# EAGLE design mainboard (EAGLE 9.5.2)
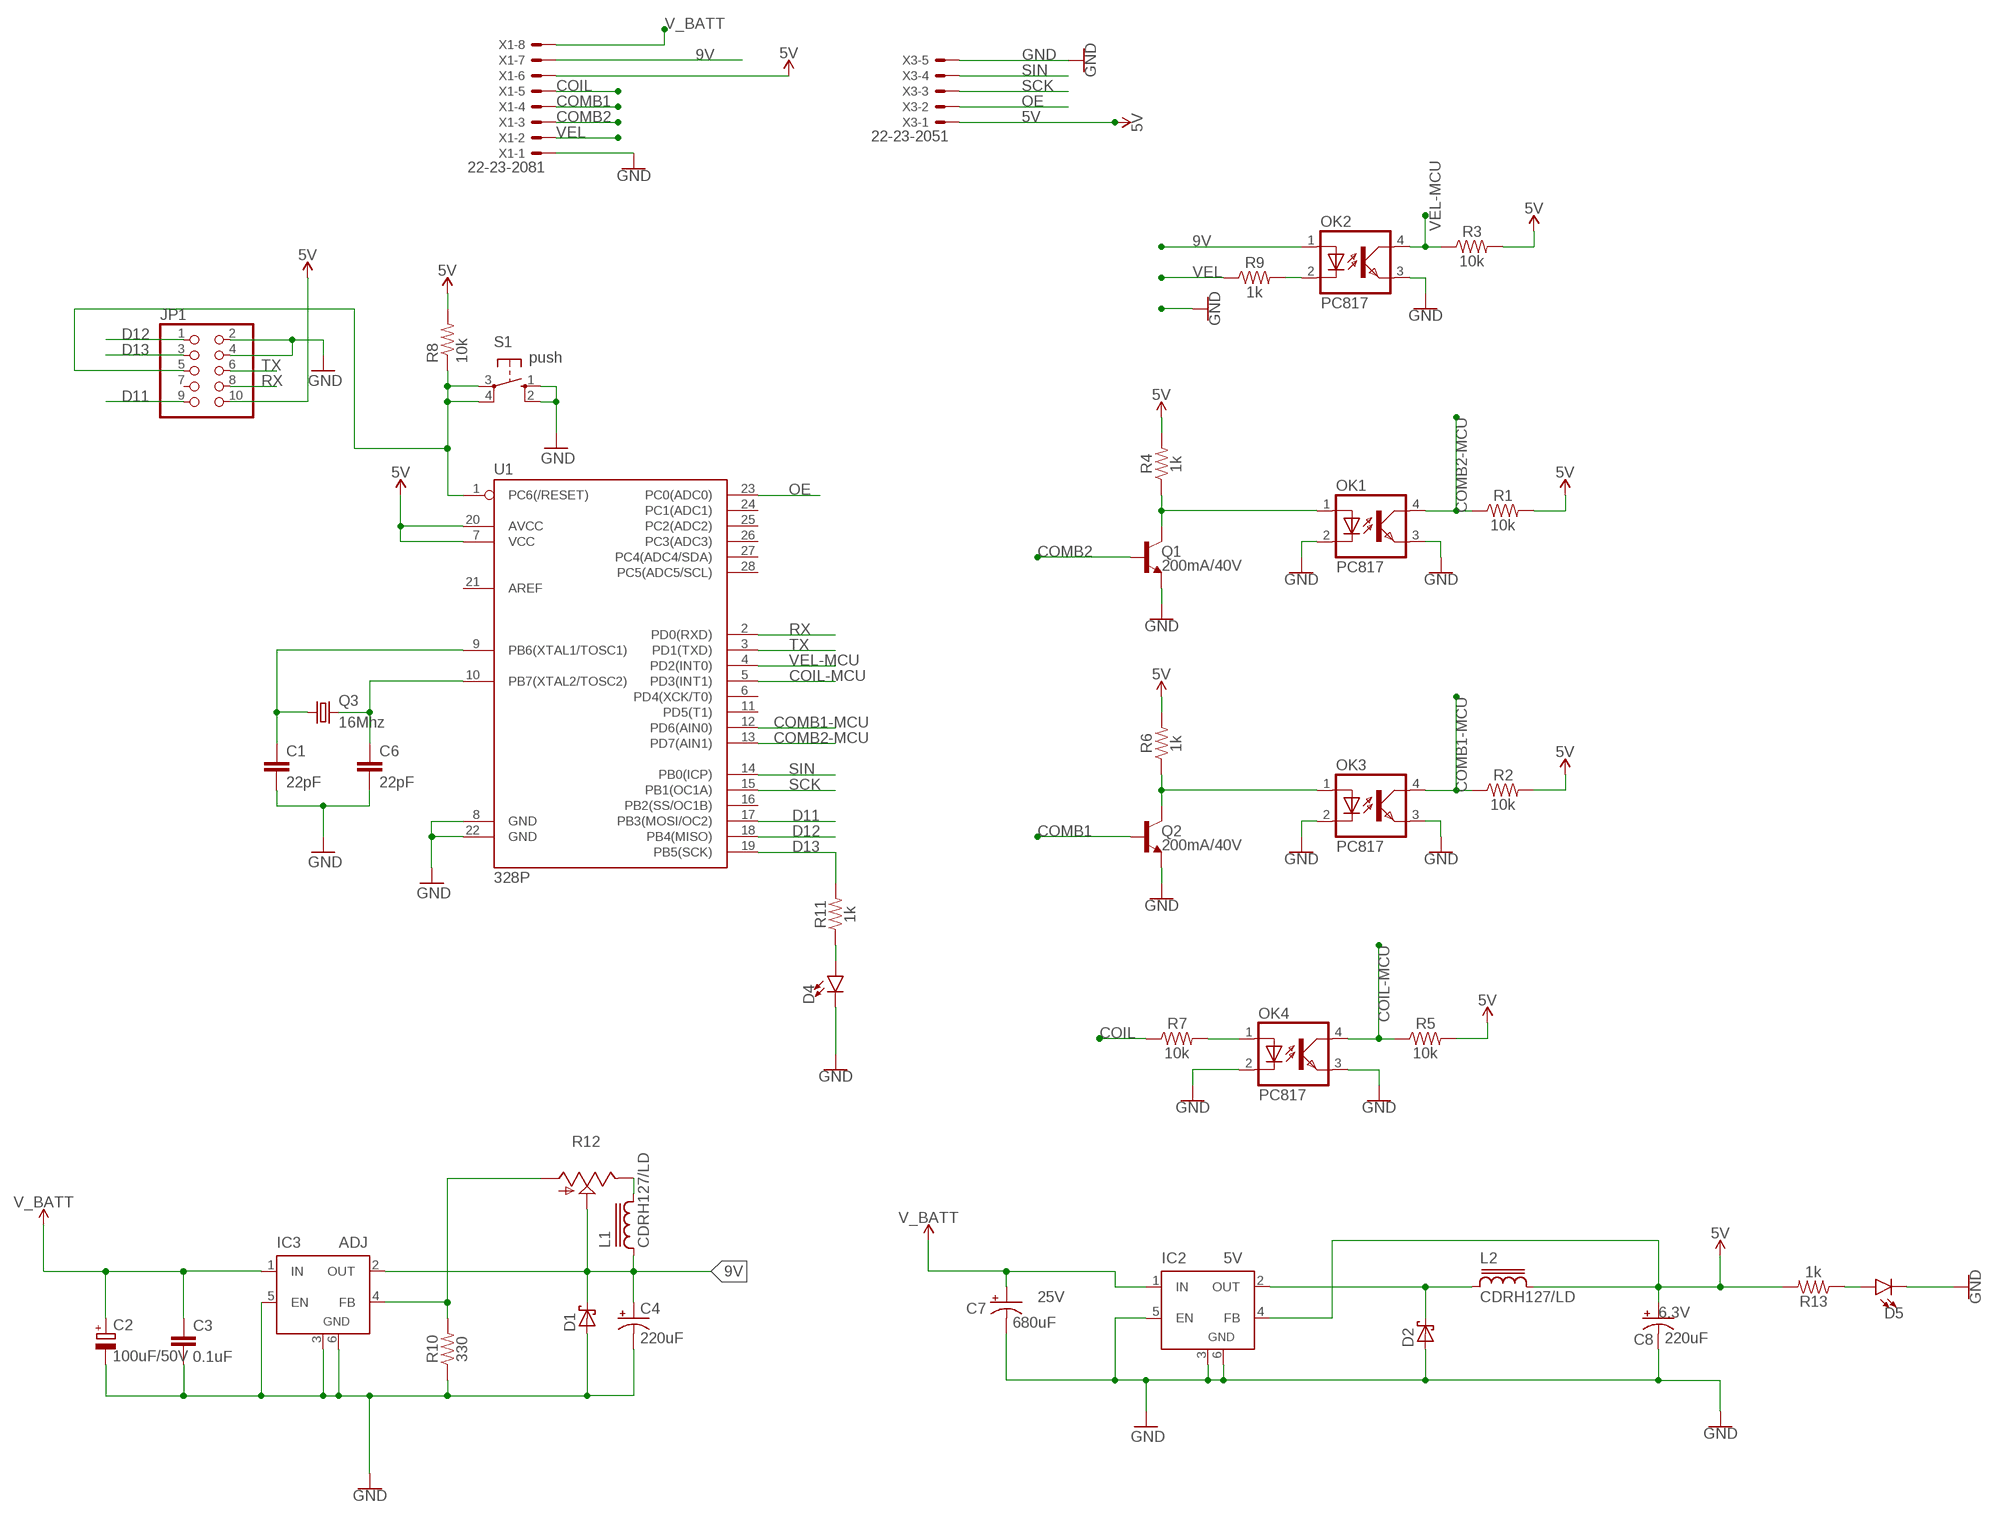
[diagram p0: schematic, sheet 1]

## Parts
C1  22pF  22PF-PTH-2.54MM-200V-5%  [CAP-PTH-2.54]
C2  100uF/50V  CPOL-EUE3.5-8  [E3,5-8]
C3  0.1uF  0.1UF-0603-25V-5%  [0603]
C4  220uF  CPOL-USUD-6,3X5,8  [UD-6,3X5,8_NICHICON]
C6  22pF  22PF-PTH-2.54MM-200V-5%  [CAP-PTH-2.54]
C7  680uF  CPOL-USE5-10.5  [E5-10,5]
C8  220uF  CPOL-USUD-6,3X5,8  [UD-6,3X5,8_NICHICON]
D1  SCHOTTKY-DIODESMD  [SMB]
D2  SCHOTTKY-DIODESMD  [SMB]
D4  LED3MM  [LED_3MM]
D5  LED3MM  [LED_3MM]
IC2  5V  LM2596S  [TO263-5]
IC3  ADJ  LM2596S  [TO263-5]
JP1  PINHD-2X5  [2X05]
L1  CDRH127/LD  [CDRH127/LD]
L2  CDRH127/LD  [CDRH127/LD]
OK1  PC817  [DIL04]
OK2  PC817  [DIL04]
OK3  PC817  [DIL04]
OK4  PC817  [DIL04]
Q1  200mA/40V  TRANS_NPN-2N3904  [TO-92]
Q2  200mA/40V  TRANS_NPN-2N3904  [TO-92]
Q3  16Mhz  CRYSTALHC49U-V  [HC49U-V]
R1  10k  10KOHM-HORIZ-1/4W-5%  [AXIAL-0.3]
R2  10k  10KOHM-HORIZ-1/4W-5%  [AXIAL-0.3]
R3  10k  10KOHM-HORIZ-1/4W-5%  [AXIAL-0.3]
R4  1k  1KOHM-HORIZ-1/4W-5%  [AXIAL-0.3]
R5  10k  10KOHM-HORIZ-1/4W-5%  [AXIAL-0.3]
R6  1k  1KOHM-HORIZ-1/4W-5%  [AXIAL-0.3]
R7  10k  10KOHM-HORIZ-1/4W-5%  [AXIAL-0.3]
R8  10k  10KOHM-HORIZ-1/4W-5%  [AXIAL-0.3]
R9  1k  1KOHM-HORIZ-1/4W-5%  [AXIAL-0.3]
R10  330  1KOHM-HORIZ-1/4W-5%  [AXIAL-0.3]
R11  1k  1KOHM-HORIZ-1/4W-5%  [AXIAL-0.3]
R12  TRIM_US-S64W  [S64W]
R13  1k  1KOHM-HORIZ-1/4W-5%  [AXIAL-0.3]
S1  push  10-XX  [B3F-10XX]
U1  328P  ATMEGA328P_PDIP  [DIP28]
X1  22-23-2081  [22-23-2081]
X3  22-23-2051  [22-23-2051]

## Nets
5V: C8.+ IC2.4(FB) JP1.10 L2.2 R1.P$2 R2.P$2 R3.P$2 R4.P$2 R5.P$2 R6.P$2 R8.P$2 R13.P$2 U1.7(VCC) U1.20(AVCC) X1.6 X3.1
9V: C4.+ D1.C IC3.2(OUT) L1.1 OK2.1(A) R12.S X1.7
COIL: R7.P$1 X1.5
COIL-MCU: OK4.4(COL) R5.P$1 U1.5(PD3(INT1))
COMB1: Q2.2(B) X1.4
COMB1-MCU: OK3.4(COL) R2.P$1 U1.12(PD6(AIN0))
COMB2: Q1.2(B) X1.3
COMB2-MCU: OK1.4(COL) R1.P$1 U1.13(PD7(AIN1))
D11: JP1.9 U1.17(PB3(MOSI/OC2))
D12: JP1.1 U1.18(PB4(MISO))
D13: JP1.3 R11.P$2 U1.19(PB5(SCK))
GND: C1.2 C2.- C3.2 C4.- C6.2 C7.- C8.- D1.A D2.A D4.K(C) D5.K(C) IC2.3(GND) IC2.5(EN) IC2.6(GND) IC3.3(GND) IC3.5(EN) IC3.6(GND) JP1.2 JP1.4 OK1.2(C) OK1.3(EMIT) OK2.3(EMIT) OK3.2(C) OK3.3(EMIT) OK4.2(C) OK4.3(EMIT) Q1.1(E) Q2.1(E) R10.P$1 S1.1(S) S1.2(S1) U1.8(GND) U1.22(GND) X1.1 X3.5
N$1: OK4.1(A) R7.P$2
N$2: OK2.2(C) R9.P$2
N$3: OK1.1(A) Q1.3(C) R4.P$1
N$4: OK3.1(A) Q2.3(C) R6.P$1
N$5: C1.1 Q3.1 U1.9(PB6(XTAL1/TOSC1))
N$6: C6.1 Q3.2 U1.10(PB7(XTAL2/TOSC2))
N$7: JP1.5 R8.P$1 S1.3(P) S1.4(P1) U1.1(PC6(/RESET))
N$8: D5.A R13.P$1
N$9: L1.2 R12.E
N$10: IC3.4(FB) R10.P$2 R12.A
N$11: D4.A R11.P$1
OE: U1.23(PC0(ADC0)) X3.2
OUT: D2.C IC2.2(OUT) L2.1
RX: JP1.8 U1.2(PD0(RXD))
SCK: U1.15(PB1(OC1A)) X3.3
SIN: U1.14(PB0(ICP)) X3.4
TX: JP1.6 U1.3(PD1(TXD))
V_BATT: C2.+ C3.1 C7.+ IC2.1(IN) IC3.1(IN) X1.8
VEL: R9.P$1 X1.2
VEL-MCU: OK2.4(COL) R3.P$1 U1.4(PD2(INT0))
Unconnected: JP1.7 U1.6(PD4(XCK/T0)) U1.11(PD5(T1)) U1.16(PB2(SS/OC1B)) U1.21(AREF) U1.24(PC1(ADC1)) U1.25(PC2(ADC2)) U1.26(PC3(ADC3)) U1.27(PC4(ADC4/SDA)) U1.28(PC5(ADC5/SCL))

## Library data of the parts
C1 C6 = SparkFun-Capacitors:22PF: 22pF ceramic capacitors A capacitor is a passive two-terminal electrical component used to store electrical energy temporarily in an electric field.; PROD_ID: CAP-09128
C2 = rcl:CPOL-EU: POLARIZED CAPACITOR, European symbol; SPICEPREFIX: C
C3 = SparkFun-Capacitors:0.1UF: 0.1µF ceramic capacitors A capacitor is a passive two-terminal electrical component used to store electrical energy temporarily in an electric field.; PROD_ID: CAP-08604
C4 = rcl:CPOL-US: POLARIZED CAPACITOR, American symbol; SPICEPREFIX: C
C7 = rcl:CPOL-US: POLARIZED CAPACITOR, American symbol; VOLTAGE: 25V
C8 = rcl:CPOL-US: POLARIZED CAPACITOR, American symbol; VOLTAGE: 6.3V
D1 D2 = diode:SCHOTTKY-DIODE: Schottky Diode
D4 D5 = SparkFun-LED:LED: LED (Generic) Standard schematic elements and footprints for 5mm, 3mm, 1206, and 0603 sized LEDs. Generic LEDs with no color specified.; PROD_ID: DIO-08794
IC2 IC3 = linear:LM2596S: STEP-DOWN VOLTAGE REGULATOR
JP1 = pinhead:PINHD-2X5: PIN HEADER
L1 L2 = inductor-sumida:CDRH127/LD: Power Inductor
OK1-OK4 = optocoupler:PC817: SHARP OPTO COUPLER; MPN: PC817X4J000F; OC_FARNELL: 9707727; OC_NEWARK: 97K7059
Q1 Q2 = SparkFun-DiscreteSemi:TRANS_NPN: NPN transistor Current controlled devices typically used to amplify current or used as a switch. BC547 - COM-08928 <http://www.sparkfun.com/products/8928> (TO-92 45V 100mA) (1.Collector 2.Base 3.Emitter) 2N3904 - COM-00521 <http://www.sparkfun.com/products/521> (TO-92 40V 200mA) (1.Emitter 2.Base 3.Collector) P2N2222A - COM-12852 <http://www.sparkfun.com/products/12852> (TO-92 40V 600mA) (1.Collector 2.Base 3.Emitter); PROD_ID: TRANS-08447
Q3 = adafruit:CRYSTAL: CRYSTAL; OC_FARNELL: 1666969; OC_NEWARK: unknown
R1-R3 R5 R7 R8 = SparkFun-Resistors:10KOHM: 10kΩ resistor A resistor is a passive two-terminal electrical component that implements electrical resistance as a circuit element. Resistors act to reduce current flow, and, at the same time, act to lower voltage levels within circuits. - Wikipedia; PROD_ID: RES-09435
R4 R6 R9 R11 R13 = SparkFun-Resistors:1KOHM: 1kΩ resistor A resistor is a passive two-terminal electrical component that implements electrical resistance as a circuit element. Resistors act to reduce current flow, and, at the same time, act to lower voltage levels within circuits. - Wikipedia; PROD_ID: RES-08380
R10 = SparkFun-Resistors:1KOHM: 1kΩ resistor A resistor is a passive two-terminal electrical component that implements electrical resistance as a circuit element. Resistors act to reduce current flow, and, at the same time, act to lower voltage levels within circuits. - Wikipedia; PROD_ID: RES-08380; VALUE: 1k
R12 = pot:TRIM_US-: POTENTIOMETER
S1 = switch-omron:10-XX: OMRON SWITCH; MPN: B3F-1000; OC_FARNELL: 176432; OC_NEWARK: 36M3542
U1 = SparkFun-IC-Microcontroller:ATMEGA328P_PDIP: Atmel 328P Through hole ATMEGA328P uC used in the Arduino 32kb flash, 1k EEPROM, 2k SRAM Datasheet <http://www.sparkfun.com/datasheets/Components/SMD/ATMega328.pdf> SparkFun Products Storefront component: AVR 28 Pin 20MHz 32K 6A/D - ATMega328P <https://www.sparkfun.com/products/9061> (COM-09061) SparkFun Simon Says - Through-Hole Soldering Kit <https://www.sparkfun.com/products/10547> (KIT-10547) SparkFun Learn to Solder - Simon Says <https://www.sparkfun.com/products/13708> (KIT-13708) SparkFun BigTime Watch Kit <https://www.sparkfun.com/products/11734> (KIT-11734) SparkFun ClockIt <https://www.sparkfun.com/products/10930> (KIT-10930) SparkFun Serial Enabled LCD Kit <https://www.sparkfun.com/products/10097> (LCD-10097) SparkFun Simon Tilts - Through Hole Soldering Kit <https://www.sparkfun.com/products/12634> (KIT-12634) SparkFun Frequency Counter Kit <https://www.sparkfun.com/products/10140> (KIT-10140) FabFM Radio Kit <https://www.sparkfun.com/products/11043> (KIT-11043) SparkFun Binary Blaster Kit <https://www.sparkfun.com/products/12037> (KIT-12037) SparkFun Metro-Gnome <https://www.sparkfun.com/products/9236> (KIT-09236) ATmega328 with Arduino Optiboot (Uno) <https://www.sparkfun.com/products/10524> (DEV-10524); PROD_ID: IC-09136
X1 = con-molex:22-23-2081: .100" (2.54mm) Center Header - 8 Pin; MF: MOLEX; MPN: 22-23-2081; OC_FARNELL: 1756826; OC_NEWARK: 01C7592
X3 = con-molex:22-23-2051: .100" (2.54mm) Center Header - 5 Pin; MF: MOLEX; MPN: 22-23-2051; OC_FARNELL: 1462952; OC_NEWARK: 38C9178

## Net classes
0 default: width 1.27 mm
1 supply1: width 1.5 mm

## Board
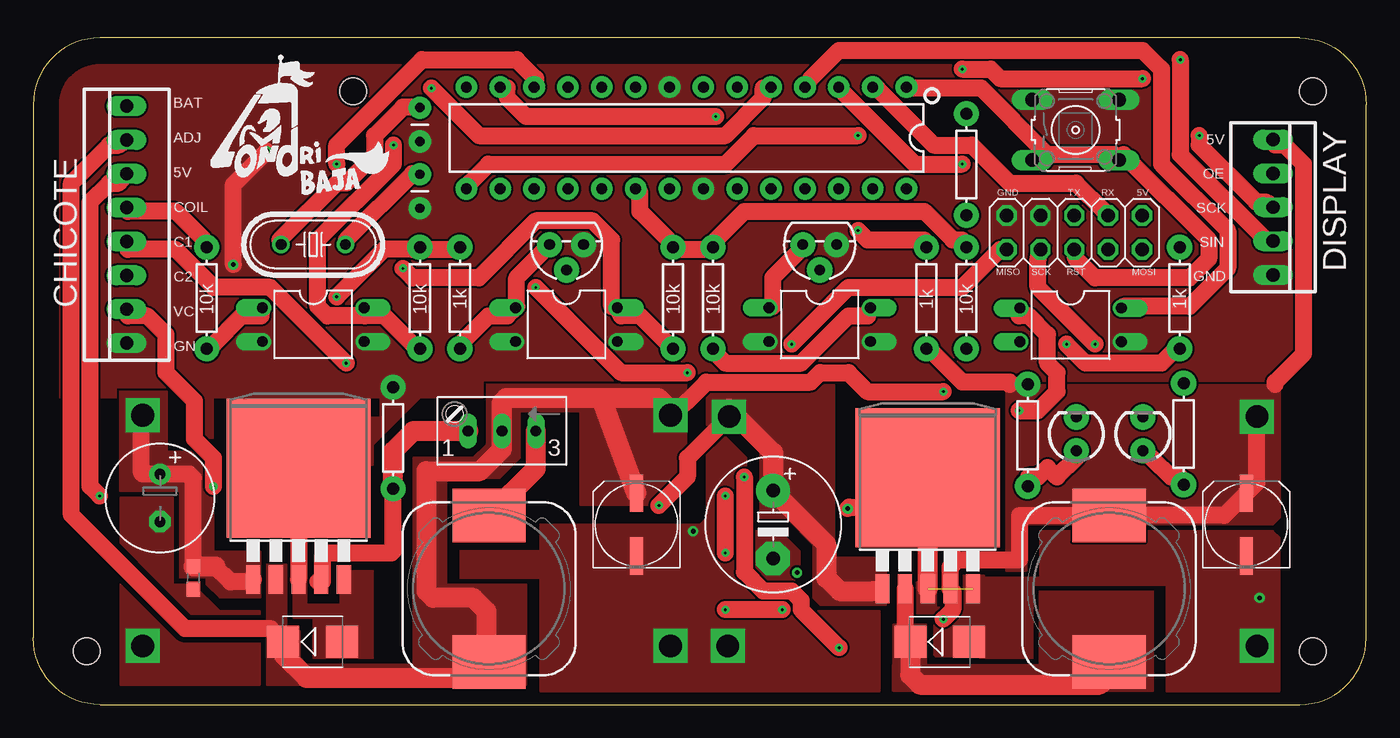
[diagram p1: board, top side]
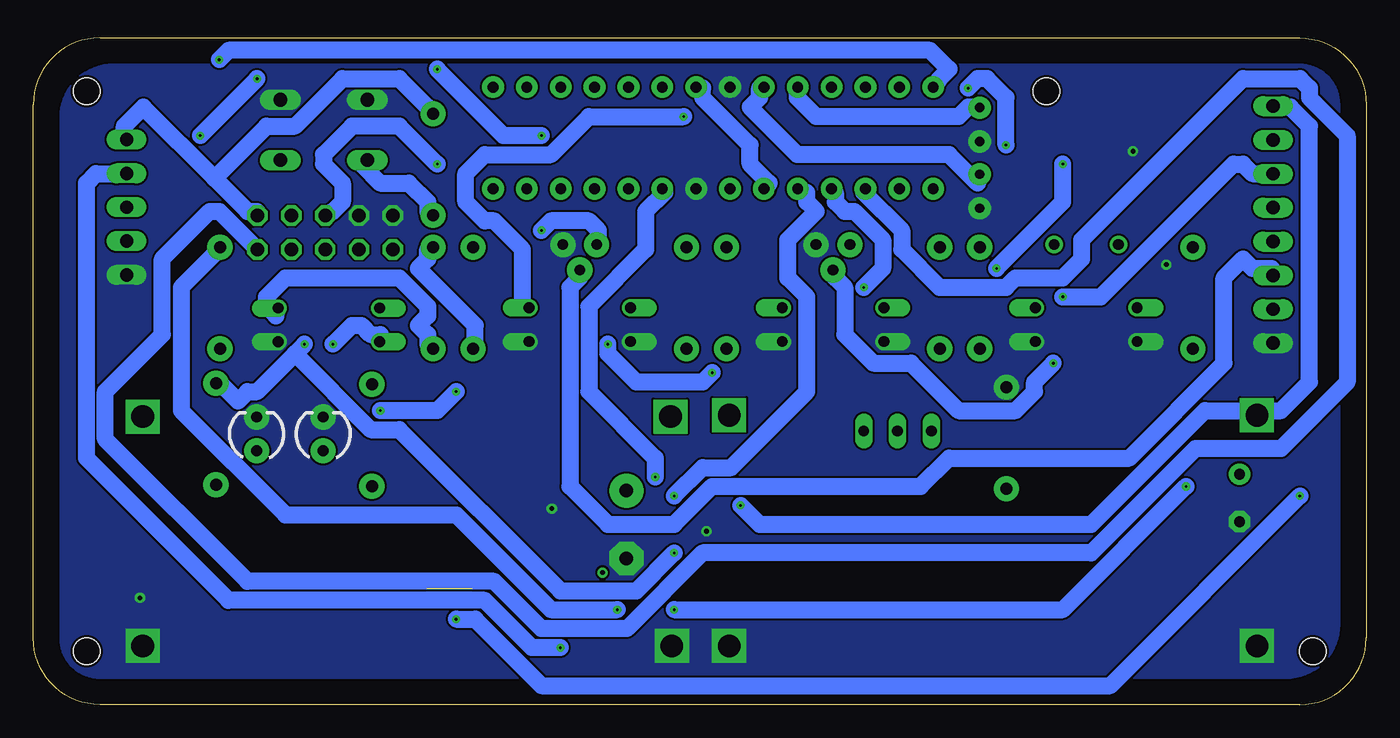
[diagram p2: board, bottom side, seen from below]

Size 100 x 50 mm. Coordinates in mm from the lower left corner, seen from the top.
Outline: 5,0 95,0 arc90 100,5 100,45 arc90 95,50 5,50 arc90 0,45 0,5 arc90 5,0
Copper layers (1*16): Top 0.035mm / dielectric 1.5mm / Bottom 0.035mm
Design rules "default *": minimum track width 0.7mm, minimum drill 0.2mm, track to track 6mil, track to pad 6mil, pad to pad 6mil, via to via 6mil, smd to smd 6mil, copper to edge 0.2mm, drill to drill 6mil, minimum pad ring 10mil, minimum via ring 8mil, stop-mask expansion 4mil, vias tented up to drill 0mil, thermal gap 10mil
Holes 2 mm at 4,4 96,4 96,46 24,46

### Footprints (pad centres in the part's own frame; a part is rotated, then mirrored left to right if it is on the bottom)
CAP-PTH-2.54 = drill 0.7 pad 1.651: 1 -1.27,0; 2 1.27,0
E3,5-8 = drill 0.813 pad 1.6: + -1.778,0 | drill 0.813 pad 1.6 octagon: - 1.778,0
0603 = smd 1.1 x 1: 1 -0.85,0; 2 0.85,0
UD-6,3X5,8_NICHICON = smd 2.8 x 1: + 2.35,0; - -2.35,0
E5-10,5 = drill 1.016 pad 2.54: + -2.54,0 | drill 1.016 pad 2.54 octagon: - 2.54,0
SMB = smd 2.4 x 2.4: A 2.2,0; C -2.2,0
LED_3MM = drill 0.813 pad 1.88: A -1.27,0; K 1.27,0
TO263-5 = smd 1.067 x 2.159: 1 -3.404,-5.791; 2 -1.702,-5.791; 3 0,-5.791; 4 1.702,-5.791; 5 3.404,-5.791 | smd 10.8 x 10.41: 6 0,2.54
2X05 = drill 1.016 octagon: 1 -5.08,-1.27; 2 -5.08,1.27; 3 -2.54,-1.27; 4 -2.54,1.27; 5 0,-1.27; 6 0,1.27; 7 2.54,-1.27; 8 2.54,1.27; 9 5.08,-1.27; 10 5.08,1.27
CDRH127/LD = smd 4 x 5.5: 1 -5.5,0; 2 5.5,0
DIL04 = drill 0.813 offset: 1 -1.27,-3.81; 2 1.27,-3.81; 3 1.27,3.81; 4 -1.27,3.81
TO-92 = drill 0.813 pad 1.88: 1 -1.27,0; 2 0,1.905; 3 1.27,0
HC49U-V = drill 0.813: 1 -2.413,0; 2 2.413,0
AXIAL-0.3 = drill 0.9 pad 1.88: P$1 -3.81,0; P$2 3.81,0
S64W = drill 0.813 long: A 2.54,1.27; E -2.54,1.27; S 0,1.27
B3F-10XX = drill 1.016 long: 1 -3.251,2.261; 2 3.251,2.261; 3 -3.251,-2.261; 4 3.251,-2.261
DIP28 = drill 0.813 pad 1.626: 1 -16.51,-3.81; 2 -13.97,-3.81; 3 -11.43,-3.81; 4 -8.89,-3.81; 5 -6.35,-3.81; 6 -3.81,-3.81; 7 -1.27,-3.81; 8 1.27,-3.81; 9 3.81,-3.81; 10 6.35,-3.81; 11 8.89,-3.81; 12 11.43,-3.81; 13 13.97,-3.81; 14 16.51,-3.81; 15 16.51,3.81; 16 13.97,3.81; 17 11.43,3.81; 18 8.89,3.81; 19 6.35,3.81; 20 3.81,3.81; 21 1.27,3.81; 22 -1.27,3.81; 23 -3.81,3.81; 24 -6.35,3.81; 25 -8.89,3.81; 26 -11.43,3.81; 27 -13.97,3.81; 28 -16.51,3.81
22-23-2081 = drill 1 long: 1 -8.89,0; 2 -6.35,0; 3 -3.81,0; 4 -1.27,0; 5 1.27,0; 6 3.81,0; 7 6.35,0; 8 8.89,0
22-23-2051 = drill 1 long: 1 -5.08,0; 2 -2.54,0; 3 0,0; 4 2.54,0; 5 5.08,0

### Placement (x,y rotation side)
C1  29,38.5 270 top
C2  9.5,15.5 270 top
C3  12,9.5 270 top
C4  45.25,13.5 90 top
C6  29,43.5 270 top
C7  55.5,13.5 270 top
C8  91,13.5 90 top
D1  20.95,4.71 0 top
D2  68,4.7 0 top
D4  83.25,20.3 90 top
D5  78.25,20.3 90 top
IC2  67.1,14.47 0 top
IC3  19.9,15.18 0 top
JP1  78.1,35.4 0 top
L1  34.19,8.69 90 top
L2  80.7,8.69 90 top
OK1  59,28.5 270 top
OK2  77.82,28.47 270 top
OK3  40,28.5 270 top
OK4  21,28.5 270 top
Q1  59,34.5 180 top
Q2  40,34.5 180 top
Q3  21,34.5 180 top
R1  51,30.5 90 top
R2  48,30.5 90 top
R3  70,30.5 90 top
R4  67,30.5 270 top
R5  29,30.5 90 top
R6  32,30.5 90 top
R7  13,30.5 270 top
R8  70,40.5 90 top
R9  86,30.5 270 top
R10  27,20 270 top
R11  86.3,20.3 90 top
R12  35.16,21.79 180 top
R13  74.6,20.2 90 top
S1  78.2,43.1 0 top
U1  49,42.5 180 top
X1  7,36 90 top
X3  93,37.3 270 top

### Tracks (layer width: path | path; a pad name or v marks a point on that pad's centre or on a via)
5V  (via drill 0.2, 1.7)
  Top 1.27: v91.8,21.6 91.8,16.65 C8.+ 89.34,14.19 L2.2 74,14.19 74,10.88 69.38,10.88 68.8,10.3 IC2.4 68.99,8.53 68.99,7.11 v68.28,6.4 | U1.20 45.52,38.41 45.52,36.98 47.65,34.85 R2.P$2 48.36,34.14 50.49,34.14 R1.P$2 51.21,34.85 53.34,36.98 66.85,36.98 68.99,34.85 69.7,34.85 R3.P$2 | v22.76,30.58 26.31,34.14 28.45,34.14 R5.P$2 29.16,34.14 31.29,34.14 R6.P$2 | X3.1 93.17,41.96 93.88,41.96 95.3,40.54 95.3,26.31 93.17,24.18 93.17,24 | R4.P$2 67.56,26.31 69.7,24.18 73.25,24.18 73.25,24 | v4.98,15.65 4.27,16.36 4.27,37.69 5.69,39.12 6.4,39.12 X1.6
  Bottom 1.27: U1.7 49.78,46.23 49.78,45.52 46.23,41.96 46.23,40.54 44.81,39.12 U1.20 | v22.76,30.58 19.91,30.58 9.96,40.54 9.25,40.54 8.53,39.83 7.11,39.83 X1.6 | 86.41,39.47 91.75,44.81 93.17,43.38 93.17,42.67 X3.1 | 86.41,39.47 83.92,36.98 83.21,36.98 JP1.10 | 86.41,39.47 82.5,43.38 80.37,43.38 76.81,46.94 72.54,46.94 70.41,44.81 R8.P$2 | v4.98,15.65 19.2,1.42 61.87,1.42 66.85,6.4 v68.28,6.4 | R3.P$2 70.41,34.14 70.41,33.43 71.12,32.72 66.85,28.45 66.85,27.03 R4.P$2
  pour Top (no thermals): 73,10 73,24 93.5,24 93.5,14 93,13.5 74.5,13.5 74.5,10
9V  (via drill 0.2, 1.7)
  Top 1.27: v73.97,22.05 75.39,22.05 76.81,23.47 76.81,24.89 76.1,25.6 76.1,27.74 74.68,29.16 73.97,29.16 OK2.1 | v68.28,23.47 62.59,23.47 61.16,24.89 59.03,24.89 58.32,24.18 50.49,24.18 49.07,22.76 v47.8,21.7 | X1.7 6.4,41.96 5.69,41.96 2.85,39.12 2.85,14.22 11.38,5.69 17.78,5.69 D1.C
  Top 1.5: 18.3,5.16 D1.C 18.75,3.75 20.5,2 33,2 L1.1 34,3.38 34,7 33,8 30,8 29.5,8.5 29.5,17.5 33.5,17.5 35.16,19.16 R12.S 35.16,22.66 35.5,23 42.5,23 | 42.5,23 46.9,23 47.8,22.1 | C4.+ 42.65,22.85 42.5,23
  Bottom 1.27: v73.97,22.05 69.7,22.05 v68.28,23.47
  pour Top (no thermals): 17.5,10.5 17.5,1.5 37,1.5 37,9 31,9 31,16.5 31,17 35,17 36.5,18.5 36.5,22 41,22 41,15 49,15 49,24 34,24 34,19.5 33,18.5 29,18.5 28.5,18.5 28.5,3 20.5,3 20,3.5 20,5.5 19,5.5 19,10.5
COIL
  Top 1.27: X1.5 7.11,36.98 10.67,36.98 12.8,34.85 R7.P$1
COIL-MCU  (via drill 0.2)
  Top 1.27: 24.89,29.16 26.31,29.16 28.45,27.03 R5.P$1 | v29.87,46.23 33.43,42.67 51.92,42.67 54.76,45.52 54.76,46.23 U1.5 | v27.03,41.96 27.03,40.54 21.34,34.85 21.34,29.87 22.05,29.16 24.89,29.16 | 24.89,29.16 OK4.4
  Bottom 1.27: v29.87,46.23 29.16,46.94 28.45,46.94 27.03,45.52 v27.03,41.96
COMB1  (via drill 0.2)
  Top 1.27: v23.47,25.6 17.78,31.29 13.51,31.29 10.67,34.14 7.11,34.14 X1.4
  Bottom 1.27: v23.47,25.6 24.89,24.18 24.89,23.47 26.31,22.05 30.58,22.05 34.14,25.6 36.98,25.6 39.12,27.74 39.12,31.29 39.83,32 Q2.2
COMB1-MCU  (via drill 0.2)
  Top 1.27: R2.P$1 47.65,27.03 45.52,29.16 44.09,29.16 OK3.4 43.38,29.87 43.38,34.85 41.96,36.27 37.69,36.27 33.43,32 28.45,32 v27.74,32.72 | v22.76,40.54 22.76,41.96 29.16,48.36 36.27,48.36 37.69,46.94 U1.12
  Bottom 1.27: v22.76,40.54 22.76,37.69 v27.74,32.72
COMB2
  Bottom 1.27: X1.3 7.11,32.72 8.53,32.72 9.25,33.43 10.67,32 10.67,25.6 17.78,18.49 31.29,18.49 33.43,16.36 49.07,16.36 51.92,13.51 56.9,13.51 59.74,16.36 59.74,31.29 59.03,32 Q1.2
COMB2-MCU  (via drill 0.2)
  Top 1.27: OK1.4 62.59,29.16 61.16,29.16 57.61,25.6 51.92,25.6 51.21,26.31 R1.P$1 | v51.21,44.09 36.98,44.09 35.56,45.52 35.56,46.23 U1.13
  Bottom 1.27: v51.21,44.09 58.32,44.09 61.16,41.25 66.14,41.25 67.56,39.83 67.56,37.69 66.14,36.27 65.43,36.27 63.3,34.14 63.3,29.87 OK1.4
D11
  Bottom 1.27: JP1.9 83.21,34.14 86.06,36.98 86.77,36.98 90.32,33.43 90.32,27.74 94.59,23.47 94.59,19.91 83.92,9.25 65.43,9.25 61.87,5.69 55.47,5.69 49.78,11.38 20.62,11.38 12.8,19.2 6.4,19.2 1.42,24.18 1.42,42.67 4.27,45.52 4.27,46.23 4.98,46.94 9.25,46.94 21.34,34.85 21.34,33.43 22.76,32 26.31,32 27.03,31.29 32,31.29 34.85,34.14 34.85,35.56 37.69,38.41 U1.17
D12  (via drill 0.2)
  Top 1.27: v56.9,27.03 61.16,31.29 69.7,31.29 72.54,34.14 JP1.1 | v49.07,24.89 44.09,24.89 v37.69,31.29
  Bottom 1.27: v56.9,27.03 56.9,26.31 54.76,24.18 49.78,24.18 v49.07,24.89 | v37.69,31.29 36.27,32.72 36.27,34.85 38.41,36.98 39.12,36.98 39.83,37.69 39.83,38.41 U1.18
D13  (via drill 0.2)
  Top 1.27: v79.65,27.03 75.39,31.29 75.39,33.43 JP1.3 | v51.92,11.38 v51.92,15.65
  Bottom 1.27: 80.37,26.31 83.21,23.47 83.92,23.47 84.63,22.76 86.06,24.18 R11.P$2 | 80.37,26.31 v79.65,27.03 | v51.92,15.65 49.78,17.78 47.65,17.78 41.96,23.47 41.96,30.58 43.38,32 43.38,34.85 41.25,36.98 41.96,37.69 41.96,38.41 U1.19 | v51.92,11.38 54.76,8.53 60.45,8.53 72.54,20.62 74.68,20.62 80.37,26.31
GND  (via drill 0.35, 1.7)  (1 unrouted)
  Top 1.27: IC3.6 IC3.3 | IC2.6 67.21,16.84 67.21,13.16 67.1,12.81 | v15,33 15,39 v17.5,41.5 | v61.1,14.7 61.2,14.8 62,14.8
  Top 1.5: 70.4,4.9 D2.A | IC2.3 67.1,12.81
  other vias: 91.8,4.4 52.1,4.4 47.8,4.4 8.2,4.4 49.5,13 92,8
  pour Top (isolate 0.4, no thermals): 6.5,15.5 6.5,1.5 17,1.5 17,7 14,7 12,9 10.5,9 10.5,15.5
  pour Top (no thermals): 19.5,10.5 19.5,6.5 21,6.5 21,3.5 25.5,3.5 25.5,10 23,10 23,7.5 20.5,7.5 20.5,10.5
  pour Top (no thermals): 11,25 11,20 13.5,20 13.5,23.5 17,23.5 17,22 23,22 23,23.5 25.5,23.5 26,23 26,21.5 24.5,21.5 24.5,18 25.5,18 25.5,19.5 29.5,23.5 27.5,25.5 15,25.5 14.5,25
  pour Top (no thermals): 69.8,9.7 71.3,9.7 71.3,3.6 67.7,3.6 67.6,3.7 67.6,6.8 66.3,6.8 66.3,9.2 67.7,9.2 67.7,7.3 69.8,7.3
  pour Top (no thermals): 32,11.5 32,9.5 37.5,9.5 38,9.5 38,1 63.5,1 63.5,7 57.5,7 57.5,11.5 56,13 54,13 53.5,13.5 53.5,18.5 52,20 50.5,20 50.5,14 50,13.5 38,13.5 38,11.5
  pour Top (no thermals): 71,3.5 75,3.5 75,9 85,9 85,1 93.5,1 93.5,12.5 93,13 75.5,13 75.5,9.5 71,9.5
  pour Bottom (no thermals): 2,43 2,45 arc-90 5,48 94,48 arc-90 98,44 98,43 98,5 arc-90 95,2 93,2 6,2 arc-90 2,6
  pour Top (isolate 0.1, rank 6, no thermals): 2,45 arc-90 5,48 94,48 arc-90 98,44 98,24 arc-90 97,23 2,23
N$1
  Top 1.27: OK4.1 17.07,29.16 15.65,29.16 13.51,27.03 R7.P$2
N$2  (via drill 0.2)
  Top 1.27: v77.52,27.03 78.94,25.6 84.63,25.6 85.34,26.31 R9.P$2
  Bottom 1.27: v77.52,27.03 76.1,28.45 75.39,28.45 74.68,27.74 73.97,27.74 OK2.2
N$3  (via drill 0.2)
  Top 1.27: OK1.1 55.47,29.87 55.47,32 57.61,34.14 Q1.3 | v61.87,35.56 62.59,34.85 66.85,34.85 R4.P$1
  Bottom 1.27: v61.87,35.56 61.16,36.27 58.32,36.27 57.61,35.56 57.61,34.85 Q1.3
N$4
  Top 1.27: R6.P$1 32,27.03 34.14,29.16 35.56,29.16 OK3.1 36.27,29.87 36.27,32 38.41,34.14 Q2.3
N$5
  Top 1.27: Q3.1 23.47,34.85 28.45,39.83 C1.1
  Bottom 1.27: U1.9 45.52,46.23 45.52,45.52 46.23,44.81 42.67,41.25 31.29,41.25 29.16,39.12 C1.1
N$6
  Top 1.27: Q3.2 18.49,34.85 22.76,39.12 23.47,39.12 25.6,41.25 25.6,42.67 27.74,44.81 28.45,44.81 C6.1
  Bottom 1.27: U1.10 42.67,46.23 42.67,45.52 41.25,44.09 30.58,44.09 29.87,44.81 29.16,44.81 C6.1
N$7
  Top 1.27: 76.1,41.25 81.08,41.25 S1.4 81.79,41.25 88.19,34.85 88.19,33.43 86.77,32 79.65,32 78.23,33.43 JP1.5 | 76.1,41.25 75.39,41.25 S1.3 76.1,41.25 | 76.1,41.25 71.12,46.23 66.14,46.23 U1.1
  Bottom 1.27: R8.P$1 70.41,36.98 70.41,37.69 71.83,39.12 73.97,39.12 75.39,40.54 S1.3
N$8
  Top 1.27: R13.P$1 74.68,17.07 75.39,17.07 76.1,17.78 76.81,17.07 78.23,18.49 D5.A
N$9
  Top 1.5: L1.2 37.7,17.7 R12.E
N$10
  Top 1.27: 21.68,9.25 21.68,11.11 21.94,11.38 26.88,11.38 27,11.5 R10.P$2 | 21.68,9.25 21.68,9.23 | IC3.4 21.34,9.25 21.68,9.25
  Top 1.5: R10.P$2 27,19 28.52,20.52 R12.A
N$11
  Top 1.27: R11.P$1 86.06,17.07 85.34,17.07 83.92,18.49 D4.A
N$12  (via drill 0.35)
  other vias: 57.3,9.9
OE  (via drill 0.2)
  Top 1.27: v60.45,4.27 57.61,7.11 57.61,7.82 56.9,8.53 54.76,8.53 53.34,9.96 v53.34,17.07
  Bottom 1.27: v60.45,4.27 62.59,4.27 66.14,7.82 85.34,7.82 96.01,18.49 96.01,39.12 95.3,39.83 93.17,39.83 X3.2 | v53.34,17.07 53.34,18.49 58.32,23.47 58.32,29.87 54.05,34.14 54.05,36.98 52.63,38.41 U1.23
OUT
  Top 1.27: IC2.2 65.4,5.1 D2.C
  Top 1.5: D2.C 65.8,2.2 66.5,1.5 80,1.5 80.7,2.2 L2.1
  pour Top (no thermals): 64.5,3 75.5,3 75.5,8.5 84,8.5 84,1 64.5,1
  pour Top (no thermals): 64.5,6 64.5,3 67,3 67,6
RX
  Top 1.27: JP1.8 80.37,36.98 78.23,39.12 73.25,39.12 70.41,41.96 67.56,41.96 63.3,46.23 U1.2
SCK  (via drill 0.2)
  Top 1.27: v87.48,42.67 87.48,41.96 91.75,37.69 92.46,37.69 X3.3 | v83.21,46.94 72.54,46.94 71.83,47.65 v69.7,47.65 | v61.87,42.67 54.05,42.67 51.92,40.54 34.14,40.54 32.72,39.12 U1.15
  Bottom 1.27: v83.21,46.94 v87.48,42.67 | v69.7,47.65 64.72,42.67 v61.87,42.67
SIN  (via drill 0.2)
  Top 1.27: v86.06,48.36 86.06,41.25 92.46,34.85 X3.4
  Bottom 1.27: v86.06,48.36 85.34,49.07 32.72,49.07 31.29,47.65 32,46.94 U1.14
TX  (via drill 0.2)
  Top 1.27: v69.7,40.54 66.14,40.54 60.45,46.23 U1.3
  Bottom 1.27: v69.7,40.54 72.54,43.38 76.1,43.38 78.23,41.25 78.23,40.54 76.81,39.12 76.81,37.69 77.52,36.98 JP1.6
V_BATT  (via drill 0.2, 1.7)
  Top 1.27: 13.65,10.35 14.79,9.21 16.32,9.21 IC3.1 | 12.4,10.35 12,10.75 12,17 11.72,17.28 C2.+ 8.22,17.28 8.1,17.4 8.1,22 8.2,22.1 | v46.94,14.94 49.07,17.07 49.07,18.49 51.92,21.34 v52.2,21.6
  Top 1.5: 13.65,10.35 12.4,10.35 C3.1 | 52.2,22.2 55.5,18.9 C7.+ 59.5,12.04 59.5,9.5 60.5,8.5 63,8.5
  Bottom 1.27: X1.8 6.4,44.81 5.69,44.81 4.27,43.38 4.27,24.18 6.4,22.05 7.82,22.05 v8.2,21.7 8.53,22.05 12.09,22.05 20.62,13.51 45.52,13.51 v46.94,14.94
  pour Top (no thermals): 17,8 14,8 13,9 13,9.5 11,9.5 11,16 7.5,16 6.5,16 6.5,23.5 10,23.5 10,19 13.5,19 13.5,11.5 17,11.5
  pour Top (no thermals): 50.5,24 50.5,21 52.5,21 54.5,19 54.5,14 56.5,14 58.5,12 58.5,8 59,7.5 64,7.5 64,11 60.1,11 60.1,24
VEL  (via drill 0.2)
  Top 1.27: v13.51,16.36 13.51,18.49 12.09,19.91 12.09,22.76 9.96,24.89 9.96,27.74 8.53,29.16 7.11,29.16 X1.2 | v56.19,7.11 v51.92,7.11
  Bottom 1.27: v13.51,16.36 22.76,7.11 v51.92,7.11 | v56.19,7.11 61.16,7.11 68.28,14.22 81.08,14.22 88.9,22.05 88.9,31.29 86.06,34.14 R9.P$1
VEL-MCU
  Top 1.27: OK2.4 81.79,29.87 86.77,29.87 89.61,32.72 89.61,35.56 84.63,40.54 84.63,47.65 83.21,49.07 60.45,49.07 58.32,46.94 U1.4
  Bottom 1.27: R3.P$1 70.41,27.03 70.41,27.74 71.12,28.45 70.41,29.16 70.41,29.87 72.54,32 81.08,32 82.5,30.58 82.5,29.87 81.79,29.16 OK2.4

### Text on the board
tPlace: BAT | ADJ | 5V | CHICOTE | 5V | OE | GND | TX | RX | 5V | COIL | SCK | C1 | SIN | C2 | MISO | SCK | RST | MOSI | GND | DISPLAY | 1k | 1k | 1k | VC | 10k | 10k | 10k | 10k | 10k | GN